# Altium schematic sheet Sheet1.SchDoc
size A; SheetNumber: 1; SheetTotal: 1
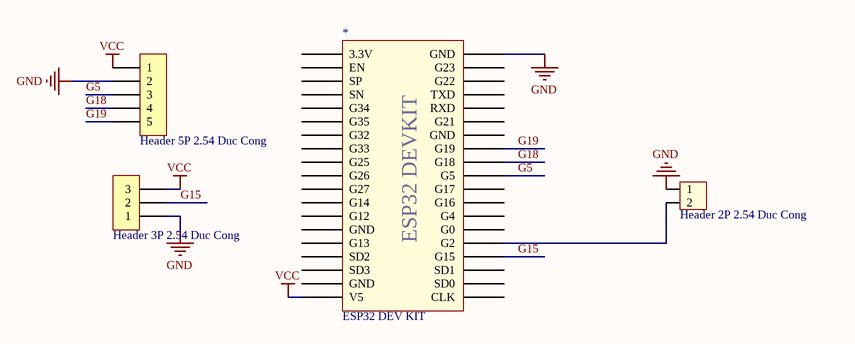
[diagram p0: Sheet1.SchDoc]

## Parts
(Parts that share a designator on the sheet are numbered #1, #2 ... from top to bottom, then left to right.)
*  ESP32 DEV KIT  [ESP32 DEVKIT]
H?#1  Header 5P 2.54 Duc Cong  [Header 5P DC 2.54]
H?#2  Header 2P 2.54 Duc Cong  [Header 2P DC 2.54]
H?#3  Header 3P 2.54 Duc Cong  [Header 3P DC 2.54]

## Nets
GND: *.38(GND) H?#1.2 H?#2.1 H?#3.1
VCC: *.19(V5) H?#1.1 H?#3.3
G5: *.29(G5) H?#1.3
G15: *.23(G15) H?#3.2
G18: *.30(G18) H?#1.4
G19: *.31(G19) H?#1.5
Net*_24: *.24(G2) H?#2.2

Not connected (* = marked no-connect by the designer): * 1(3.3V) 2(EN) 3(SP) 4(SN) 5(G34) 6(G35) 7(G32) 8(G33) 9(G25) 10(G26) 11(G27) 12(G14) 13(G12) 14(GND) 15(G13) 16(SD2) 17(SD3) 18(GND) 20(CLK) 21(SD0) 22(SD1) 25(G0) 26(G4) 27(G16) 28(G17) 32(GND) 33(G21) 34(RXD) 35(TXD) 36(G22) 37(G23)

## Notes on the sheet
- (in symbol ESP32 DEV KIT) ESP32 DEVKIT

## Library data of the parts
H?#1 = Header 5P 2.54 Duc Cong: Cắm; Ten_Linh_Kien: Header 5P XH2.54-5P Đực Cong; Don_Vi: Con; Ma_Hang: MH001308; Chung_Loai: Cắm
H?#2 = Header 2P 2.54 Duc Cong: Cắm; Ten_Linh_Kien: Header 2P XH2.54-2P Đực Cong; Don_Vi: Con; Ma_Hang: MH002852; Chung_Loai: Cắm
H?#3 = Header 3P 2.54 Duc Cong: Cắm; Ten_Linh_Kien: Header 3P XH2.54-3P Đực Cong; Don_Vi: Con; Ma_Hang: MH001302; Chung_Loai: Cắm